# EAGLE design laser_pcb (EAGLE 9.6.2)
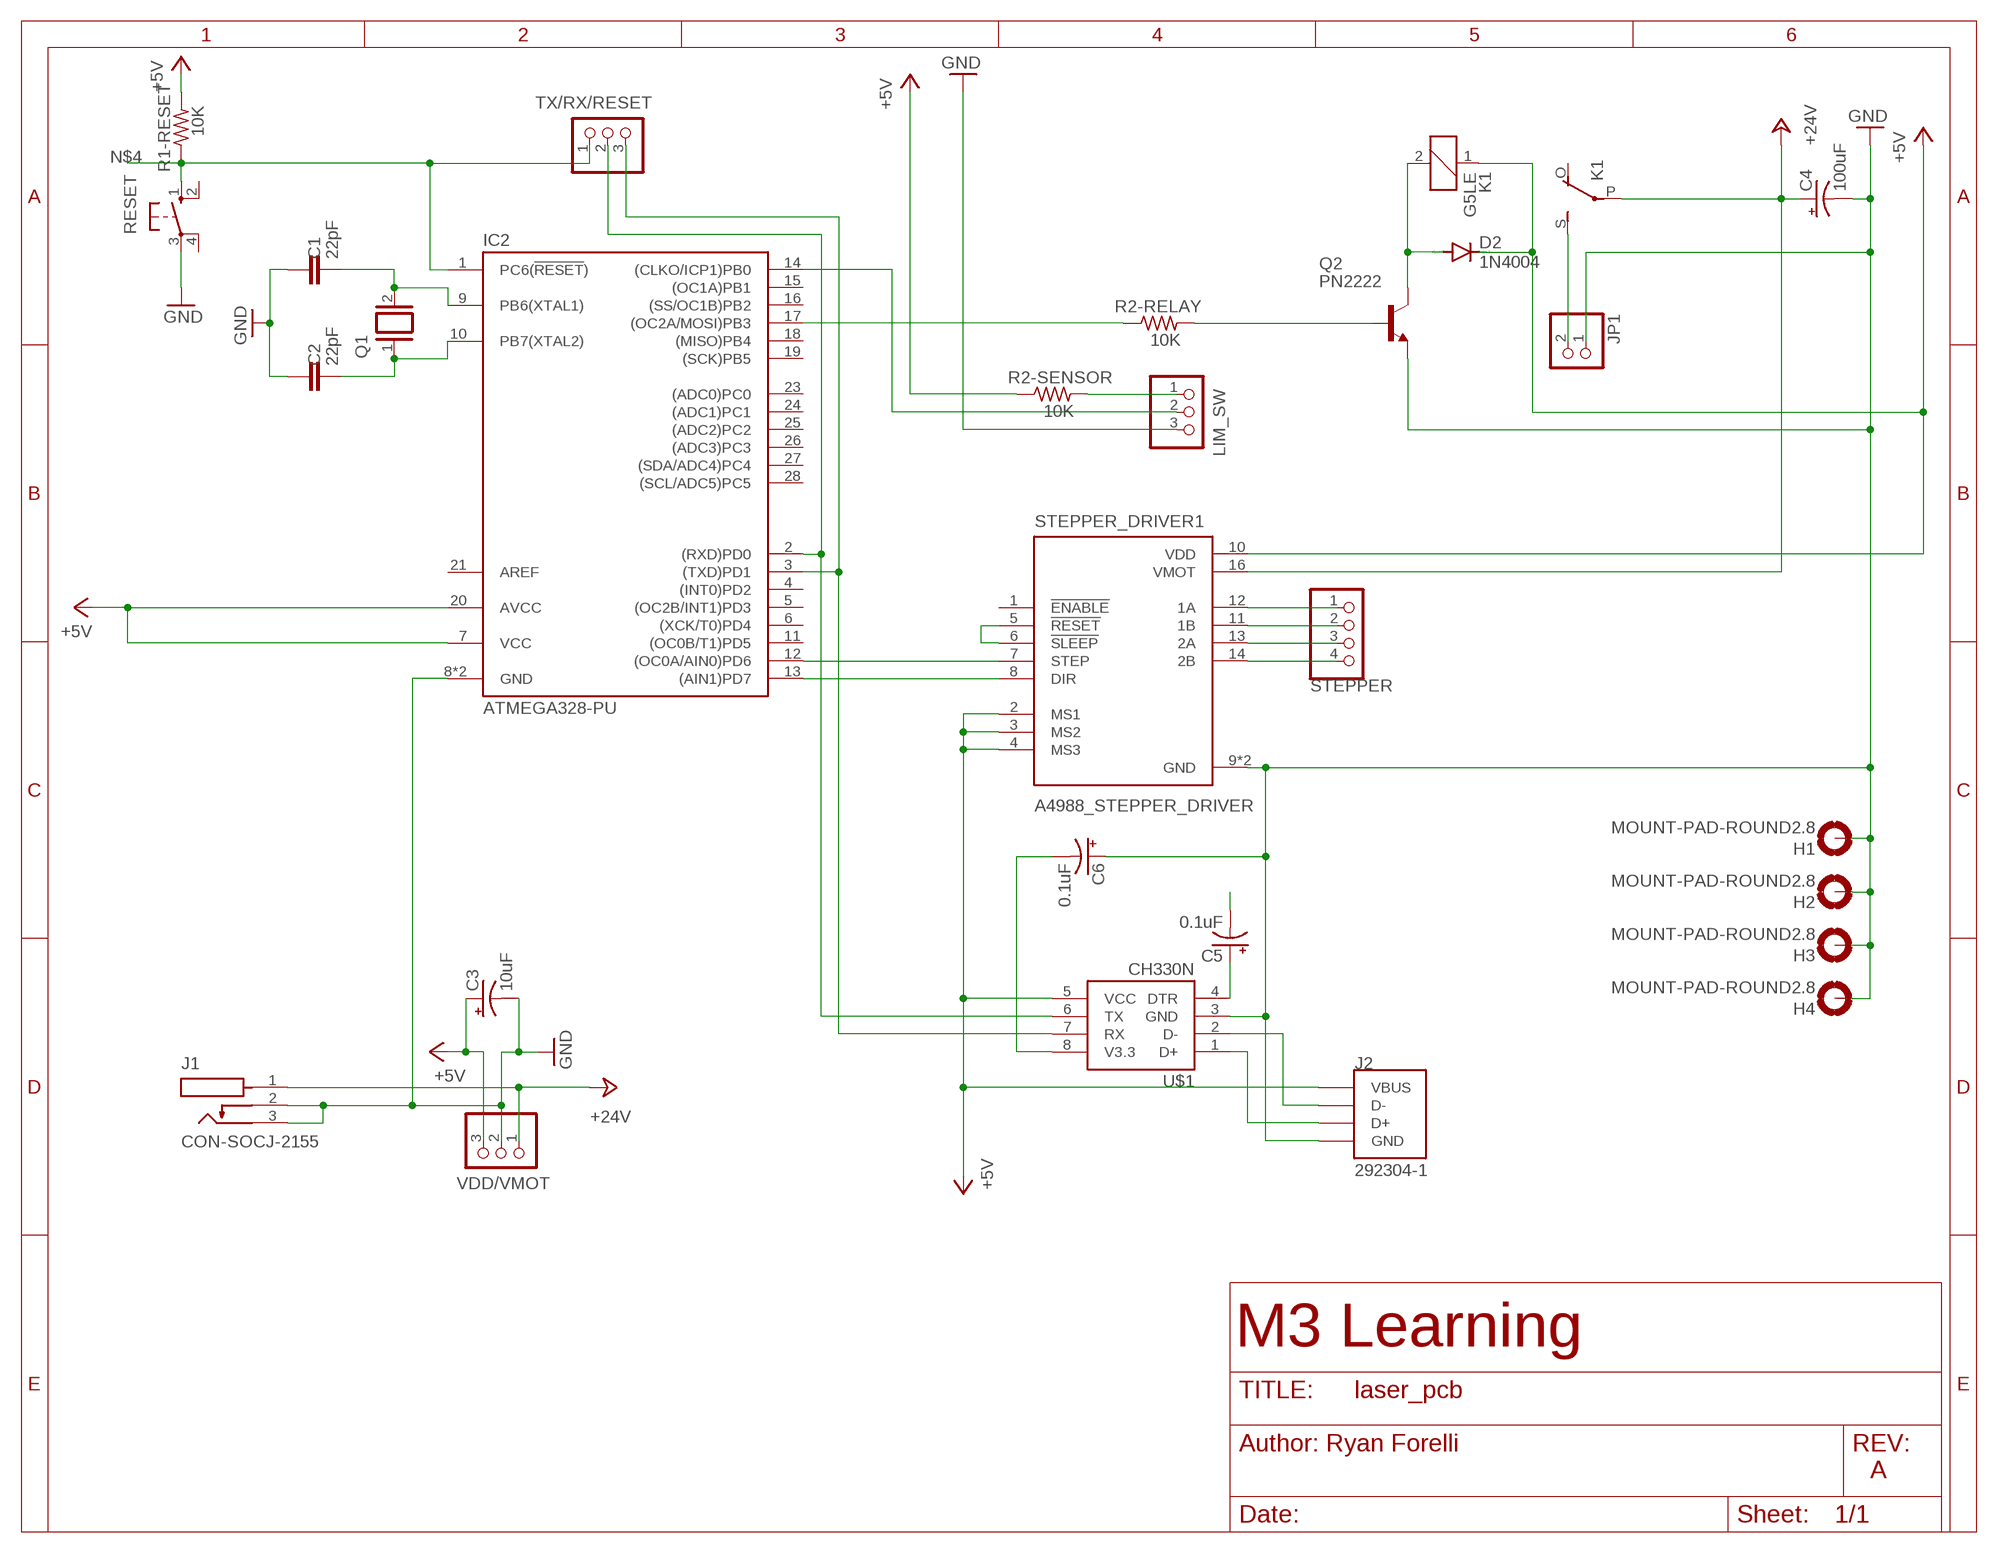
[diagram p0: schematic, sheet 1]

## Parts
C1  22pF  22PF-PTH-2.54MM-200V-5%  [CAP-PTH-2.54]
C2  22pF  22PF-PTH-2.54MM-200V-5%  [CAP-PTH-2.54]
C3  10uF  10UF-POLAR-RADIAL-2.5MM-25V-20%  [CPOL-RADIAL-2.5MM-5MM]
C4  100uF  10UF-POLAR-RADIAL-2.5MM-25V-20%  [CPOL-RADIAL-2.5MM-5MM]
C5  0.1uF  10UF-POLAR-RADIAL-2.5MM-25V-20%  [CPOL-RADIAL-2.5MM-5MM]
C6  0.1uF  10UF-POLAR-RADIAL-2.5MM-25V-20%  [CPOL-RADIAL-2.5MM-5MM]
D2  1N4004  [DO41-10]
H1  MOUNT-PAD-ROUND2.8  [2,8-PAD]
H2  MOUNT-PAD-ROUND2.8  [2,8-PAD]
H3  MOUNT-PAD-ROUND2.8  [2,8-PAD]
H4  MOUNT-PAD-ROUND2.8  [2,8-PAD]
IC2  ATMEGA328-PU  [DIL28]
J1  CON-SOCJ-2155  [GRAVITECH_CON-SOCJ-2155]
J2  292304-1  [TE_292304-1]
JP1  PINHD-1X2  [1X02]
K1  G5LE  [G5LE]
LIM_SW  PINHD-1X3  [1X03]
Q1  XTAL/S  [QS]
Q2  PN2222  [TO92]
R1-RESET  10K  R-US_0204/7  [0204/7]
R2-RELAY  10K  R-US_0204/7  [0204/7]
R2-SENSOR  10K  R-US_0204/7  [0204/7]
RESET  10-XX  [B3F-10XX]
STEPPER  PINHD-1X4  [1X04]
STEPPER_DRIVER1  A4988_STEPPER_DRIVER  A4988_STEPPER_MOTOR_DRIVER_CARRIER  [MODULE_A4988_STEPPER_MOTOR_DRIVER_CARRIER]
TX/RX/RESET  PINHD-1X3  [1X03]
U$1  CH330N  [SOIC8]
VDD/VMOT  PINHD-1X3  [1X03]

## Nets
+5V: C3.1(+) D2.C IC2.7(VCC) IC2.20(AVCC) J2.1(VBUS) K1.1 R1-RESET.2 R2-SENSOR.1 STEPPER_DRIVER1.2(MS1) STEPPER_DRIVER1.3(MS2) STEPPER_DRIVER1.4(MS3) STEPPER_DRIVER1.10(VDD) U$1.5(VCC) VDD/VMOT.3
+24V: C4.1(+) J1.1 K1.P(2:P) STEPPER_DRIVER1.16(VMOT) VDD/VMOT.1
GND: C1.1 C2.1 C3.2(-) C4.2(-) C6.1(+) H1.B2,8(MOUNT) H2.B2,8(MOUNT) H3.B2,8(MOUNT) H4.B2,8(MOUNT) IC2.8(GND) IC2.22(GND) J1.2 J1.3 J2.4(GND) JP1.1 LIM_SW.3 Q2.1(E) RESET.3(P) STEPPER_DRIVER1.9(GND) STEPPER_DRIVER1.15(GND) U$1.3(GND) VDD/VMOT.2
N$2: C1.2 IC2.9(PB6(XTAL1)) Q1.2
N$3: C2.2 IC2.10(PB7(XTAL2)) Q1.1
N$4: C5.2(-) IC2.1(PC6(!RESET!)) R1-RESET.1 RESET.1(S) TX/RX/RESET.1
N$5: STEPPER_DRIVER1.5(!RESET) STEPPER_DRIVER1.6(!SLEEP)
N$6: IC2.13((AIN1)PD7) STEPPER_DRIVER1.8(DIR)
N$7: IC2.12((OC0A/AIN0)PD6) STEPPER_DRIVER1.7(STEP)
N$8: STEPPER.1 STEPPER_DRIVER1.12(1A)
N$9: STEPPER.2 STEPPER_DRIVER1.11(1B)
N$10: STEPPER.3 STEPPER_DRIVER1.13(2A)
N$11: STEPPER.4 STEPPER_DRIVER1.14(2B)
N$12: LIM_SW.1 R2-SENSOR.2
N$13: Q2.2(B) R2-RELAY.2
N$14: IC2.14((CLKO/ICP1)PB0) LIM_SW.2
N$15: JP1.2 K1.S(2:S)
N$16: D2.A K1.2 Q2.3(C)
N$17: IC2.17((OC2A/MOSI)PB3) R2-RELAY.1
N$18: J2.2(D-) U$1.2(D-)
N$19: J2.3(D+) U$1.1(D+)
N$20: C5.1(+) U$1.4(DTR)
N$21: C6.2(-) U$1.8(V3.3)
N$38: IC2.2((RXD)PD0) TX/RX/RESET.2 U$1.6(TX)
N$39: IC2.3((TXD)PD1) TX/RX/RESET.3 U$1.7(RX)
Unconnected: IC2.4((INT0)PD2) IC2.5((OC2B/INT1)PD3) IC2.6((XCK/T0)PD4) IC2.11((OC0B/T1)PD5) IC2.15((OC1A)PB1) IC2.16((SS/OC1B)PB2) IC2.18((MISO)PB4) IC2.19((SCK)PB5) IC2.21(AREF) IC2.23((ADC0)PC0) IC2.24((ADC1)PC1) IC2.25((ADC2)PC2) IC2.26((ADC3)PC3) IC2.27((SDA/ADC4)PC4) IC2.28((SCL/ADC5)PC5) K1.O(2:O) RESET.2(S1) RESET.4(P1) STEPPER_DRIVER1.1(!ENABLE)

## Notes on the sheet
- M3 Learning
- A

## Library data of the parts
C1 C2 = SparkFun-Capacitors:22PF: 22pF ceramic capacitors A capacitor is a passive two-terminal electrical component used to store electrical energy temporarily in an electric field.; PROD_ID: CAP-09128
C3 = SparkFun-Capacitors:10UF-POLAR: 10.0µF polarized capacitors A capacitor is a passive two-terminal electrical component used to store electrical energy temporarily in an electric field.; PROD_ID: CAP-08440
C4-C6 = SparkFun-Capacitors:10UF-POLAR: 10.0µF polarized capacitors A capacitor is a passive two-terminal electrical component used to store electrical energy temporarily in an electric field.; PROD_ID: CAP-08440; VALUE: 10uF
D2 = diode:1N4004: DIODE general purpose rectifier, 1 A
H1-H4 = holes:MOUNT-PAD-ROUND: MOUNTING PAD, round
IC2 = ATMEGA328-PU:ATMEGA328-PU: Atmel ATmega48/88/168/328 AVR Microcontroller; AVAILABILITY: Unavailable; DESCRIPTION: AVR AVR® ATmega Microcontroller IC 8-Bit 20MHz 32KB _16K x 16_ FLASH 28-PDIP; MF: Microchip Technology; MP: ATMEGA328-PU; PACKAGE: DIP-28 Microchip Technology; PRICE: None
J1 = CON-SOCJ-2155:CON-SOCJ-2155: DC Power Connectors Power Jack/Connector 2.1mm x 5.5mm Check prices <https://pricing.snapeda.com/parts/CON-SOCJ-2155/Gravitech/view-part?ref=eda>; AVAILABILITY: In Stock; DESCRIPTION: DC Power Connectors Power Jack/Connector 2.1mm x 5.5mm; MF: Gravitech; MP: CON-SOCJ-2155; PACKAGE: None; PRICE: None
J2 = 292304-1:292304-1: CONN USB RECEPT R/A TYPE B 4POS Check prices <https://pricing.snapeda.com/parts/292304-1/TE%20Connectivity/view-part?ref=eda>; AVAILABILITY: In Stock; CENTERLINE_PITCH: 2.5 mm[.098 in]; COMMENT: 292304-1; DESCRIPTION: USB-B (USB TYPE-B) USB 2.0 Receptacle Connector 4 Position Through Hole, Right Angle; EU_ROHS_COMPLIANCE: Compliant; MF: TE Connectivity; MP: 292304-1; NUMBER_OF_POSITIONS: 4; PACKAGE: None; PRICE: None; PRODUCT_TYPE: Connector; PURCHASE-URL: https://pricing.snapeda.com/search/part/292304-1/?ref=eda
JP1 = pinhead:PINHD-1X2: PIN HEADER
K1 = relay:G5LE: RELAY 1 x switch, 10 A/120 V AC, 8 A/30 V DC, Omron; OC_FARNELL: unknown; OC_NEWARK: unknown
LIM_SW TX/RX/RESET VDD/VMOT = pinhead:PINHD-1X3: PIN HEADER
Q1 = special:XTAL/S: CRYSTAL
Q2 = PN2222:PN2222: NPN Transistor Check prices <https://pricing.snapeda.com/parts/PN2222/ON%20Semiconductor/view-part?ref=eda>; AVAILABILITY: In Stock; DESCRIPTION: Bipolar (BJT) Transistor NPN 30V 600mA 300MHz 625mW Through Hole TO-92-3; MF: ON Semiconductor; MP: PN2222; PACKAGE: TO-226-3 National Semiconductor; PRICE: None
R1-RESET R2-RELAY R2-SENSOR = rcl:R-US_: RESISTOR, American symbol; SPICEPREFIX: R
RESET = switch-omron:10-XX: OMRON SWITCH; MPN: B3F-1000; OC_FARNELL: 176432; OC_NEWARK: 36M3542
STEPPER = pinhead:PINHD-1X4: PIN HEADER
STEPPER_DRIVER1 = A4988_STEPPER_MOTOR_DRIVER_CARRIER:A4988_STEPPER_MOTOR_DRIVER_CARRIER: Stepper motor controler; IC: A4988; 1A; Uin mot: 8÷35V; AVAILABILITY: Unavailable; DESCRIPTION: Stepper Motor Driver; MF: Pololu; MP: A4988 STEPPER MOTOR DRIVER CARRIER; PACKAGE: None; PRICE: None
U$1 = ch330n:CH330N

## Board
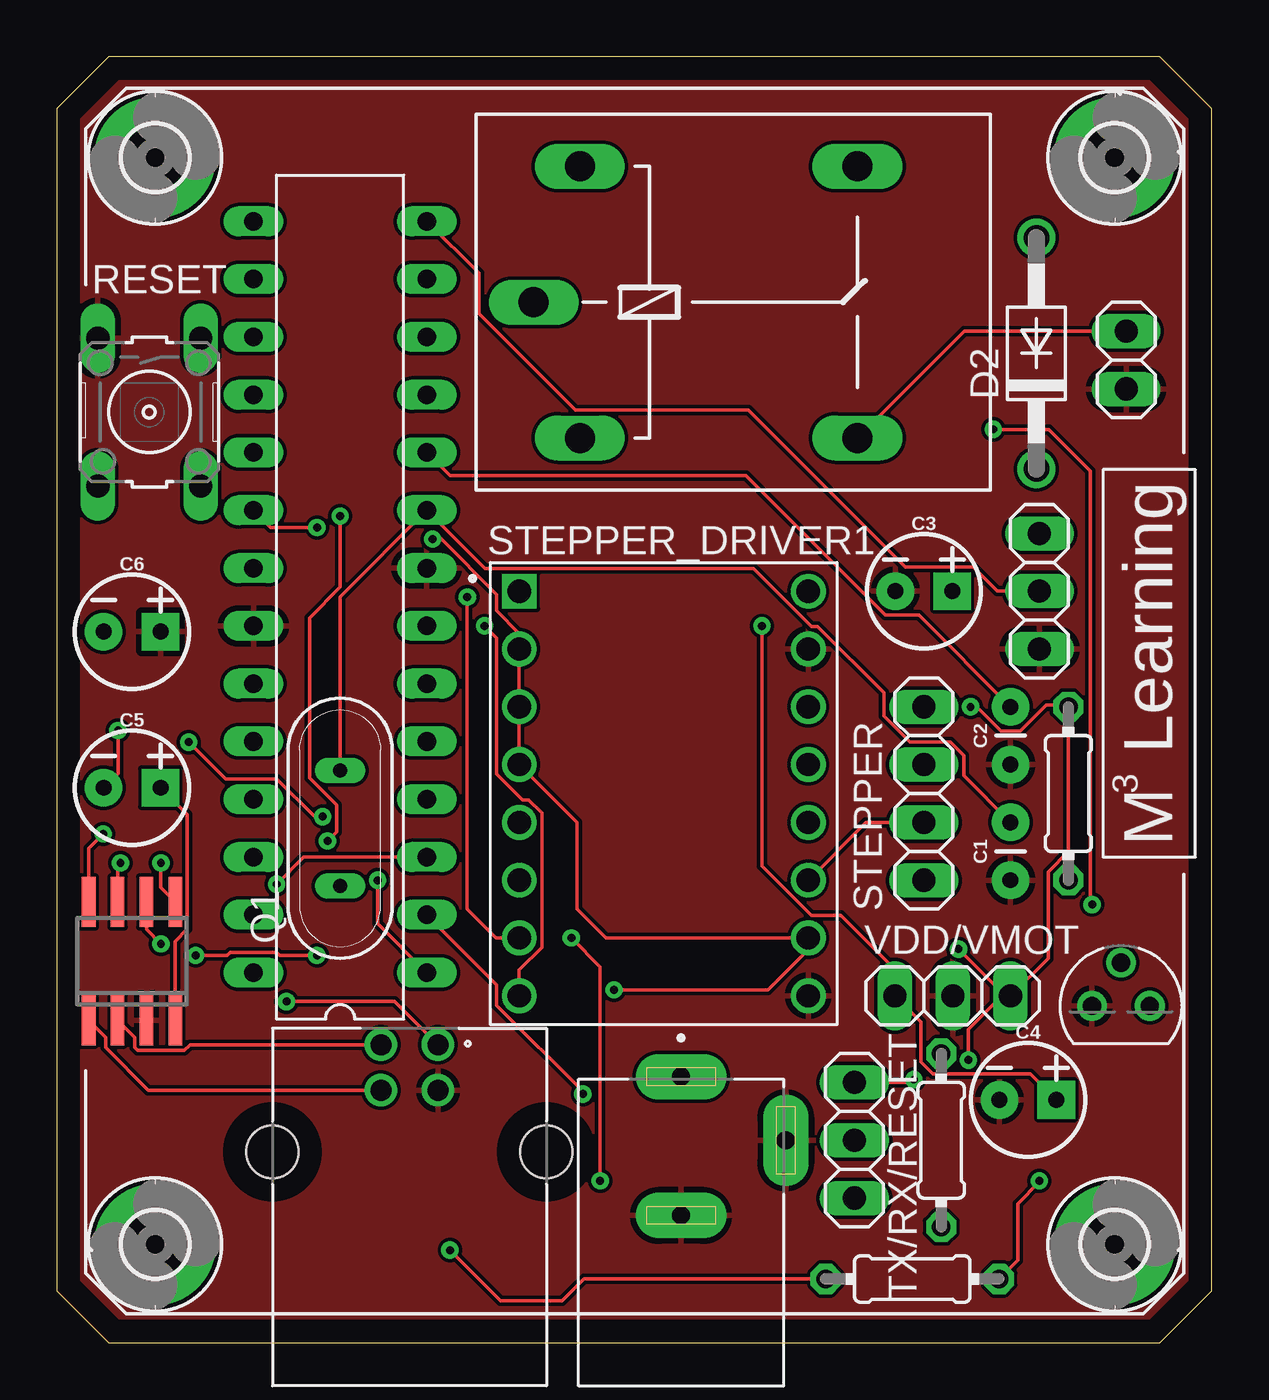
[diagram p1: board, top side]
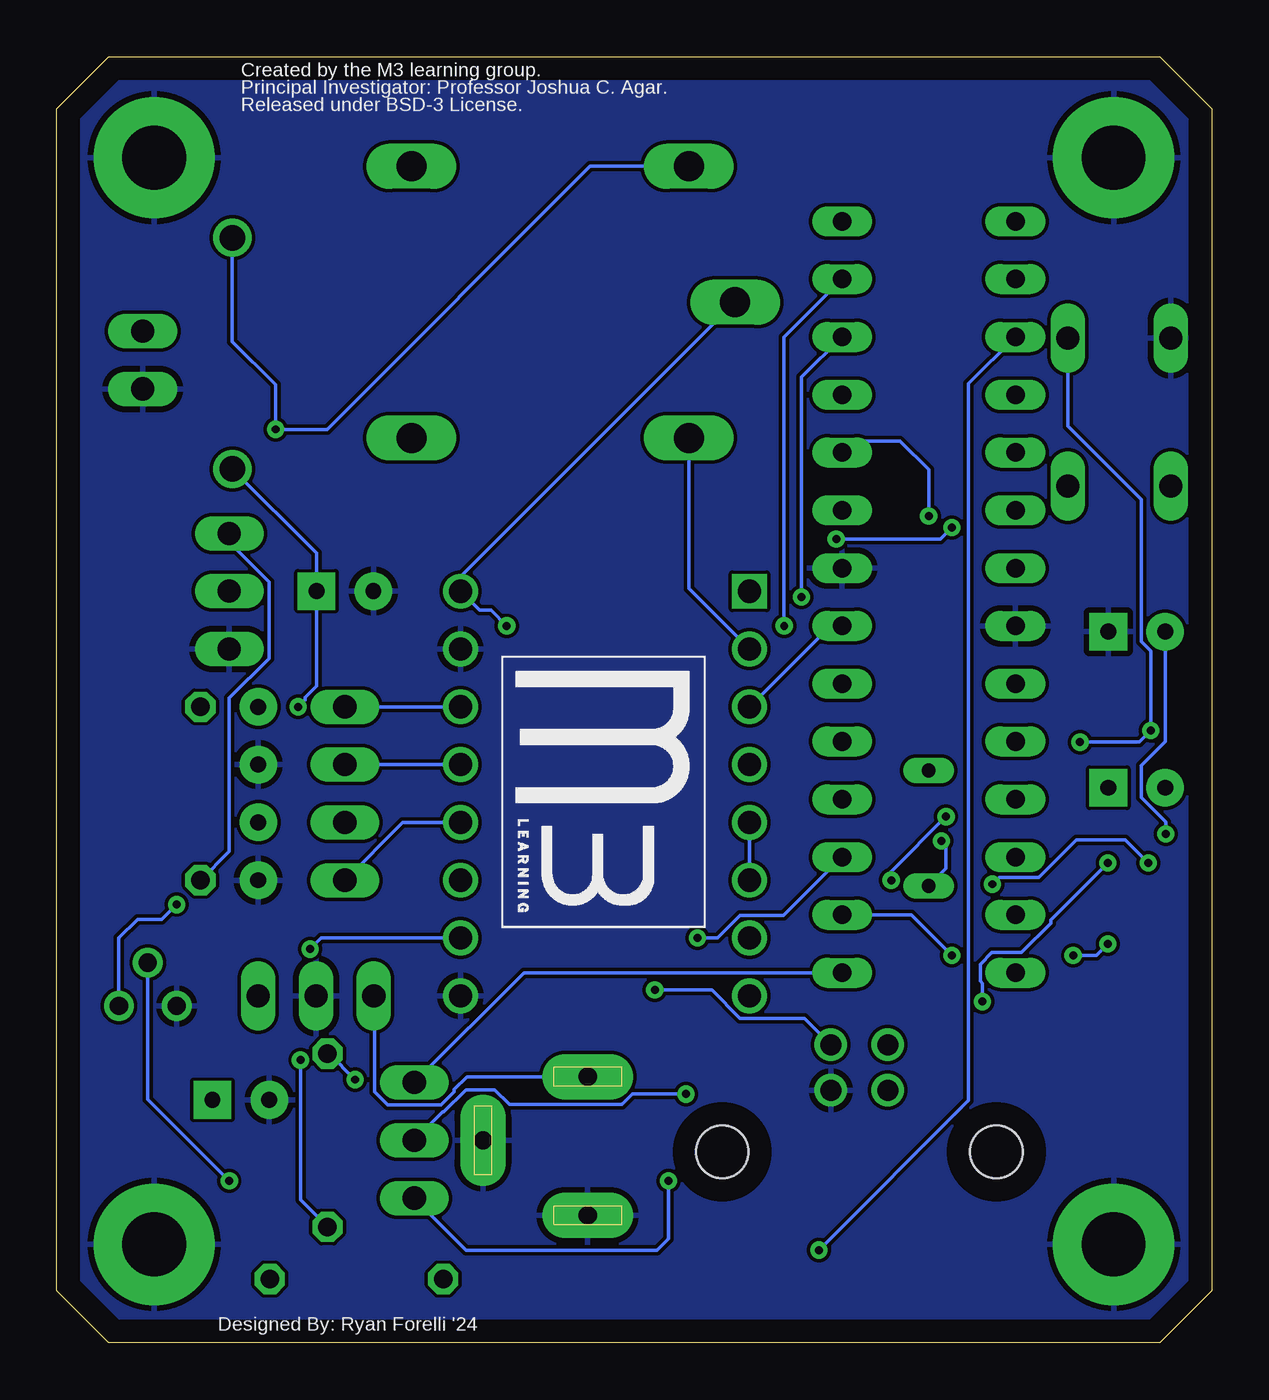
[diagram p2: board, bottom side, seen from below]

Size 50.76 x 56.5 mm. Coordinates in mm from the lower left corner, seen from the top.
Outline: 2.29,56.5 0,54.21 0,2.29 2.29,0 48.47,0 50.76,2.29 50.76,54.21 48.47,56.5 2.29,56.5
Copper layers (1*16): Top 0.035mm / dielectric 1.5mm / Bottom 0.035mm
Design rules "default": minimum track width 6mil, minimum drill 0.35mm, track to track 6mil, track to pad 6mil, pad to pad 6mil, via to via 6mil, smd to smd 6mil, copper to edge 40mil, drill to drill 6mil, minimum pad ring 10mil, minimum via ring 8mil, stop-mask expansion 4mil, vias tented up to drill 0mil, thermal gap 10mil

### Footprints (pad centres in the part's own frame; a part is rotated, then mirrored left to right if it is on the bottom)
CAP-PTH-2.54 = drill 0.7 pad 1.651: 1 -1.27,0; 2 1.27,0
CPOL-RADIAL-2.5MM-5MM = drill 0.7 pad 1.651 square: 1 1.25,0 | drill 0.7 pad 1.651: 2 -1.25,0
DO41-10 = drill 1.118: A 5.08,0; C -5.08,0
2,8-PAD = drill 2.8 pad 5.334: B2,8 0,0
DIL28 = drill 0.813 long: 1 -3.81,16.51; 2 -3.81,13.97; 3 -3.81,11.43; 4 -3.81,8.89; 5 -3.81,6.35; 6 -3.81,3.81; 7 -3.81,1.27; 8 -3.81,-1.27; 9 -3.81,-3.81; 10 -3.81,-6.35; 11 -3.81,-8.89; 12 -3.81,-11.43; 13 -3.81,-13.97; 14 -3.81,-16.51; 15 3.81,-16.51; 16 3.81,-13.97; 17 3.81,-11.43; 18 3.81,-8.89; 19 3.81,-6.35; 20 3.81,-3.81; 21 3.81,-1.27; 22 3.81,1.27; 23 3.81,3.81; 24 3.81,6.35; 25 3.81,8.89; 26 3.81,11.43; 27 3.81,13.97; 28 3.81,16.51
GRAVITECH_CON-SOCJ-2155 = drill 0.8 pad 2 long: 1 6.1,0; 2 3.3,-4.6; 3 0,0
TE_292304-1 = drill 0.92: 1 1.25,4.71; 2 -1.25,4.71; 3 -1.25,2.71; 4 1.25,2.71 | hole 2.3: -6.02,0; 6.02,0
1X02 = drill 1.016 long: 1 -1.27,0; 2 1.27,0
G5LE = drill 1.321 long: 1 -7.493,-5.969; 2 -7.493,5.969; O 4.699,5.969; P -9.525,0; S 4.699,-5.969
1X03 = drill 1.016 long: 1 -2.54,0; 2 0,0; 3 2.54,0
QS = drill 0.61 long: 1 -2.54,0; 2 2.54,0
TO92 = drill 0.8: 1 -1.27,0; 2 0,1.905; 3 1.27,0
0204/7 = drill 0.813 octagon: 1 -3.81,0; 2 3.81,0
B3F-10XX = drill 1.016 long: 1 -3.251,2.261; 2 3.251,2.261; 3 -3.251,-2.261; 4 3.251,-2.261
1X04 = drill 1.016 long: 1 -3.81,0; 2 -1.27,0; 3 1.27,0; 4 3.81,0
MODULE_A4988_STEPPER_MOTOR_DRIVER_CARRIER = drill 1.02 square: 1 -6.35,8.89 | drill 1.02: 2 -6.35,6.35; 3 -6.35,3.81; 4 -6.35,1.27; 5 -6.35,-1.27; 6 -6.35,-3.81; 7 -6.35,-6.35; 8 -6.35,-8.89; 9 6.35,-8.89; 10 6.35,-6.35; 11 6.35,-3.81; 12 6.35,-1.27; 13 6.35,1.27; 14 6.35,3.81; 15 6.35,6.35; 16 6.35,8.89
SOIC8 = smd 0.6 x 2.2: 1 -1.905,-2.6; 2 -0.635,-2.6; 3 0.635,-2.6; 4 1.905,-2.6; 5 1.905,2.6; 6 0.635,2.6; 7 -0.635,2.6; 8 -1.905,2.6

### Placement (x,y rotation side)
C1  41.91,21.59 90 top
C2  41.91,26.67 90 top
C3  38.1,33.02 0 top
C4  42.67,10.67 0 top
C5  3.3,24.38 0 top
C6  3.3,31.24 0 top
D2  43.05,43.47 90 top
H1  4.32,4.32 0 top
H2  46.48,4.32 0 top
H3  46.48,52.07 0 top
H4  4.32,52.07 0 top
IC2  12.45,32.77 180 top
J1  27.43,5.59 90 top
J2  15.49,8.38 0 top
JP1  46.99,43.18 90 top
K1  30.48,45.72 0 top
LIM_SW  43.18,33.02 270 top
Q1  12.45,22.61 90 top
Q2  46.76,14.79 0 top
R1-RESET  38.86,8.89 270 top
R2-RELAY  37.59,2.79 0 top
R2-SENSOR  44.45,24.13 270 top
RESET  4.06,40.89 270 top
STEPPER  38.1,24.13 90 top
STEPPER_DRIVER1  26.67,24.13 0 top
TX/RX/RESET  35.05,8.89 270 top
U$1  3.3,16.76 0 top
VDD/VMOT  39.37,15.24 0 top

### Tracks (layer width: path | path; a pad name or v marks a point on that pad's centre or on a via)
+5V  (via drill 0.35)
  Top 0.152: STEPPER_DRIVER1.2 STEPPER_DRIVER1.3 STEPPER_DRIVER1.4 | VDD/VMOT.3 43.56,16.89 43.56,20.69 44.45,21.58 R2-SENSOR.1 44.36,28.03 43.83,28.03 | VDD/VMOT.3 41.53,15.24 40.06,13.77 40.06,12.43 v40.05,12.42 | 43.83,28.03 | 43.83,28.03 43.49,28.03 42.35,26.89 41.47,26.89 40.42,27.94 v40.16,27.94 | STEPPER_DRIVER1.4 22.86,22.86 22.86,19.05 24.13,17.78 STEPPER_DRIVER1.10 33.02,17.27 31.24,15.49 v24.48,15.49 | v39.62,17.3 41.68,15.24 VDD/VMOT.3 | U$1.5 4.57,20 v4.57,21.08 | v10.09,14.99 14.85,14.99 J2.1 | v16.51,35.31 16.9,35.31 19.33,32.88 19.33,32.16 20.32,31.17 STEPPER_DRIVER1.4 | v11.43,35.81 9.4,35.81 IC2.20
  Bottom 0.152: K1.1 22.99,33.15 STEPPER_DRIVER1.2 | v40.16,27.94 39.85,28.24 39.85,28.35 39.35,28.85 C3.1 39.35,34.7 D2.C | STEPPER_DRIVER1.10 39.14,17.78 v39.62,17.3 | STEPPER_DRIVER1.3 16.76,31.5 IC2.7 | v4.57,21.08 7.09,18.57 7.09,18.43 8.37,17.14 9.66,17.14 10.19,16.62 10.19,15.89 10.09,15.79 v10.09,14.99 | v16.51,35.31 11.94,35.31 v11.43,35.81 | v24.48,15.49 21.98,15.49 20.73,14.25 17.9,14.25 J2.1 | v40.05,12.42 40.05,6.27 R1-RESET.2
+24V  (via drill 0.35)
  Top 0.152: C4.1 42.78,11.81 38.49,11.81 37.97,12.33 37.97,14.1 VDD/VMOT.1 36.83,16.39 34.45,18.77 33.16,18.77 30.99,20.95 v30.99,31.5
  Bottom 0.152: J1.1 32.73,11.69 33.3,11.12 33.3,11.02 33.88,10.44 36.22,10.44 36.8,11.02 36.8,15.21 VDD/VMOT.1 | K1.P 33.02,33.66 STEPPER_DRIVER1.16 32.19,32.19 31.68,32.19 v30.99,31.5
GND
  pour Bottom: 0,54.21 0,2.29 2.29,0 48.45,0 50.74,2.29 50.74,54.21 48.47,56.49 2.28,56.49
  pour Top: 0,54.23 0,2.29 2.29,0 48.45,0 50.74,2.29 50.74,54.21 48.47,56.49 2.26,56.49
N$2
  Top 0.152: Q1.2 12.45,32.77 IC2.9 18.82,34.01 30.62,34.01 33.16,31.47 33.43,31.47 36.35,28.56 36.35,27.53 37.49,26.39 39.27,26.39 39.85,25.81 39.85,24.92 C1.2
N$3  (via drill 0.35)
  Top 0.152: C2.2 37.88,31.97 36.41,31.97 30.28,38.1 17.27,38.1 IC2.10 | v12.45,36.32 12.45,33.2 11.1,31.85 11.1,24.82 12.29,23.63 12.29,22.45 v11.89,22.05
  Bottom 0.152: IC2.10 15.75,39.62 13.72,39.62 12.45,38.35 v12.45,36.32 | v11.89,22.05 11.68,21.84 11.68,20.83 Q1.1
N$4  (via drill 0.35)
  Top 0.152: IC2.1 14.09,18.42 v14.09,20.32 | v2.69,26.9 2.69,25.02 C5.2 | v11.68,23.11 11.32,23.11 9.66,24.77 7.42,24.77 v5.8,26.39 | TX/RX/RESET.1 37.53,11.43 v37.66,11.56
  Bottom 0.152: TX/RX/RESET.1 30.23,16.26 IC2.1 | v14.09,20.32 14.09,20.7 v11.68,23.11 | RESET.1 6.33,40.27 3.11,37.05 3.11,30.8 2.69,30.38 v2.69,26.9 3.2,26.39 v5.8,26.39 | v37.66,11.56 38.8,12.7 R1-RESET.1
N$5
  Bottom 0.152: STEPPER_DRIVER1.5 STEPPER_DRIVER1.6
N$6  (via drill 0.35)
  Top 0.152: v18.8,31.5 19.33,30.97 19.33,24.99 20.46,23.85 20.73,23.85 21.31,23.27 21.31,17.37 20.32,16.38 STEPPER_DRIVER1.8
  Bottom 0.152: IC2.13 18.8,44.2 v18.8,31.5
N$7  (via drill 0.35)
  Top 0.152: v18.03,32.77 18.03,19.05 19.3,17.78 STEPPER_DRIVER1.7
  Bottom 0.152: IC2.12 18.03,42.42 v18.03,32.77
N$8
  Bottom 0.152: STEPPER_DRIVER1.12 35.56,22.86 STEPPER.1
N$9
  Top 0.152: STEPPER_DRIVER1.11 35.56,22.86 STEPPER.2
N$10
  Bottom 0.152: STEPPER_DRIVER1.13 STEPPER.3
N$11
  Bottom 0.152: STEPPER_DRIVER1.14 STEPPER.4
N$12
  Bottom 0.152: R2-SENSOR.2 43.18,21.59 43.18,28.32 41.43,30.07 41.43,33.43 43.18,35.18 LIM_SW.1
N$13  (via drill 0.35)
  Top 0.152: R2-RELAY.2 42.22,3.61 42.22,6.1 43.18,7.06 v43.18,7.11
  Bottom 0.152: v43.18,7.11 46.76,10.69 Q2.2
N$14
  Top 0.152: LIM_SW.2 41.32,33.02 40.27,34.07 37.29,34.07 30.39,40.97 22.78,40.97 18.54,45.21 18.54,46.99 IC2.14
N$15
  Top 0.152: K1.S 39.88,44.45 JP1.2
N$16  (via drill 0.35)
  Top 0.152: v41.15,40.13 43.58,40.13 45.41,38.31 45.41,19.33 v45.49,19.25
  Bottom 0.152: K1.2 27.33,51.69 38.89,40.13 v41.15,40.13 41.15,42.09 43.05,43.98 D2.A | v45.49,19.25 46.15,18.59 47.22,18.59 48.03,17.78 Q2.3
N$17  (via drill 0.35)
  Top 0.152: R2-RELAY.1 23.17,2.79 22.2,1.83 19.51,1.83 v17.27,4.06
  Bottom 0.152: v17.27,4.06 10.69,10.64 10.69,36.83 10.69,36.94 10.69,42.14 IC2.17
N$18
  Top 0.152: U$1.2 3.41,13.42 3.41,12.97 3.54,12.84 5.6,12.84 5.86,13.09 J2.2
N$19
  Top 0.152: U$1.1 2.14,13.42 2.14,12.97 4.02,11.09 J2.3
N$20
  Top 0.152: U$1.4 5.21,17.64 5.74,18.17 5.74,23.2 C5.1
N$21  (via drill 0.35)
  Top 0.152: U$1.8 1.4,21.72 v2.03,22.35
  Bottom 0.152: v2.03,22.35 2.03,22.87 3.11,23.95 3.11,25.36 2.05,26.42 C6.2
N$38  (via drill 0.35)
  Top 0.152: IC2.2 19.33,15.73 19.33,14.83 23.11,11.04 v23.11,10.92 | v11.43,17.02 9.79,17.02 9.66,17.14 7.61,17.14 7.48,17.02 v6.1,17.02 | v4.57,17.53 3.94,18.16 U$1.6
  Bottom 0.152: v23.11,10.92 25.46,10.92 25.92,10.46 30.87,10.46 31.52,11.12 32.77,11.12 33.75,10.13 33.81,10.13 TX/RX/RESET.2 | IC2.2 13.21,18.8 v11.43,17.02 | v6.1,17.02 5.08,17.02 v4.57,17.53
N$39  (via drill 0.35)
  Top 0.152: U$1.7 2.67,20.95 v2.79,21.08 | v9.65,20.14 10.84,21.34 IC2.3 | v22.61,17.78 23.88,16.51 v23.88,7.11
  Bottom 0.152: v23.88,7.11 23.88,4.57 24.38,4.06 32.77,4.06 TX/RX/RESET.3 | v9.65,20.14 9.35,20.45 7.61,20.45 5.96,22.1 3.81,22.1 v2.79,21.08 | v22.61,17.78 21.73,17.78 20.73,18.77 18.82,18.77 IC2.3

### Text on the board
tPlace: Learning | 3 | M
bPlace: Created by the M3 learning group. | Principal Investigator: Professor Joshua C. Agar. | Released under BSD-3 License. | Designed By: Ryan Forelli '24 | C:/Users/capta/Desktop/m3_newbord1.bmp